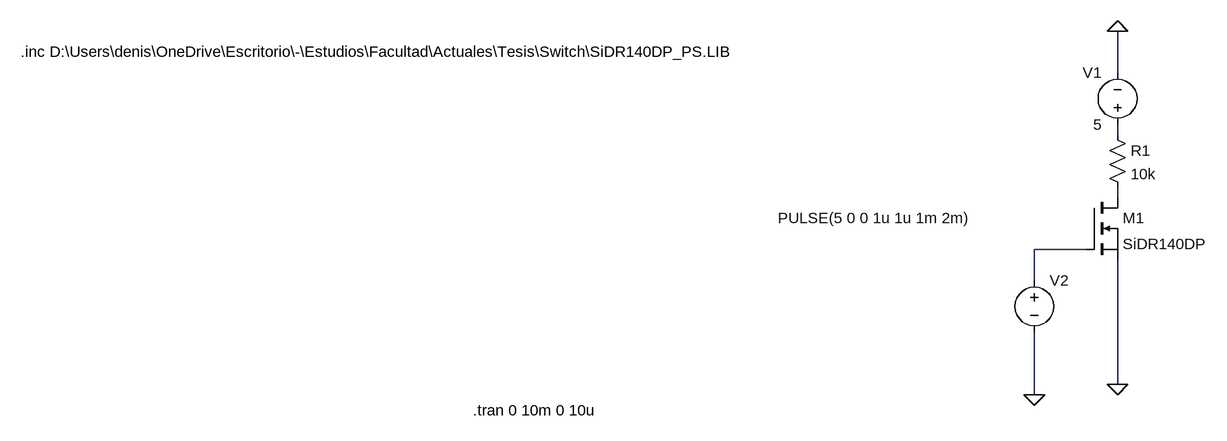
[diagram p0: schematic version0_nmos.asc]
version0_nmos.asc, the LTspice schematic file:
Version 4.1
SHEET 1 1736 680
WIRE 800 -240 800 -304
WIRE 800 -144 800 -160
WIRE 800 -48 800 -64
WIRE 752 32 672 32
WIRE 672 80 672 32
WIRE 800 240 800 48
WIRE 672 256 672 160
FLAG 672 256 0
FLAG 800 240 0
FLAG 800 -304 0
SYMBOL voltage 800 -144 R180
WINDOW 0 24 96 Left 2
WINDOW 3 24 16 Left 2
WINDOW 123 0 0 Left 0
WINDOW 39 0 0 Left 0
SYMATTR InstName V1
SYMATTR Value 5
SYMBOL voltage 672 64 R0
WINDOW 3 -395 -80 Left 2
WINDOW 123 0 0 Left 0
WINDOW 39 0 0 Left 0
SYMATTR InstName V2
SYMATTR Value PULSE(5 0 0 1u 1u 1m 2m)
SYMBOL res 784 -160 R0
SYMATTR InstName R1
SYMATTR Value 10k
SYMBOL nmos 752 -48 R0
SYMATTR InstName M1
SYMATTR Value SiDR140DP
SYMATTR Prefix X
TEXT -192 280 Left 2 !.tran 0 10m 0 10u
TEXT -888 -272 Left 2 !.inc D:\\Users\\denis\\OneDrive\\Escritorio\\-\\Estudios\\Facultad\\Actuales\\Tesis\\Switch\\SiDR140DP_PS.LIB

The netlist it stands for:
* version0_nmos.asc
V1 N001 0 5
V2 N003 0 PULSE(5 0 0 1u 1u 1m 2m)
R1 N001 N002 10k
X§M1 N002 N003 0 SiDR140DP  ; pins D G S
.tran 0 10m 0 10u
.inc D:\Users\denis\OneDrive\Escritorio\-\Estudios\Facultad\Actuales\Tesis\Switch\SiDR140DP_PS.LIB
.backanno
.end